# EAGLE design CAN_LED_dimmer_final (EAGLE 7.7.0)
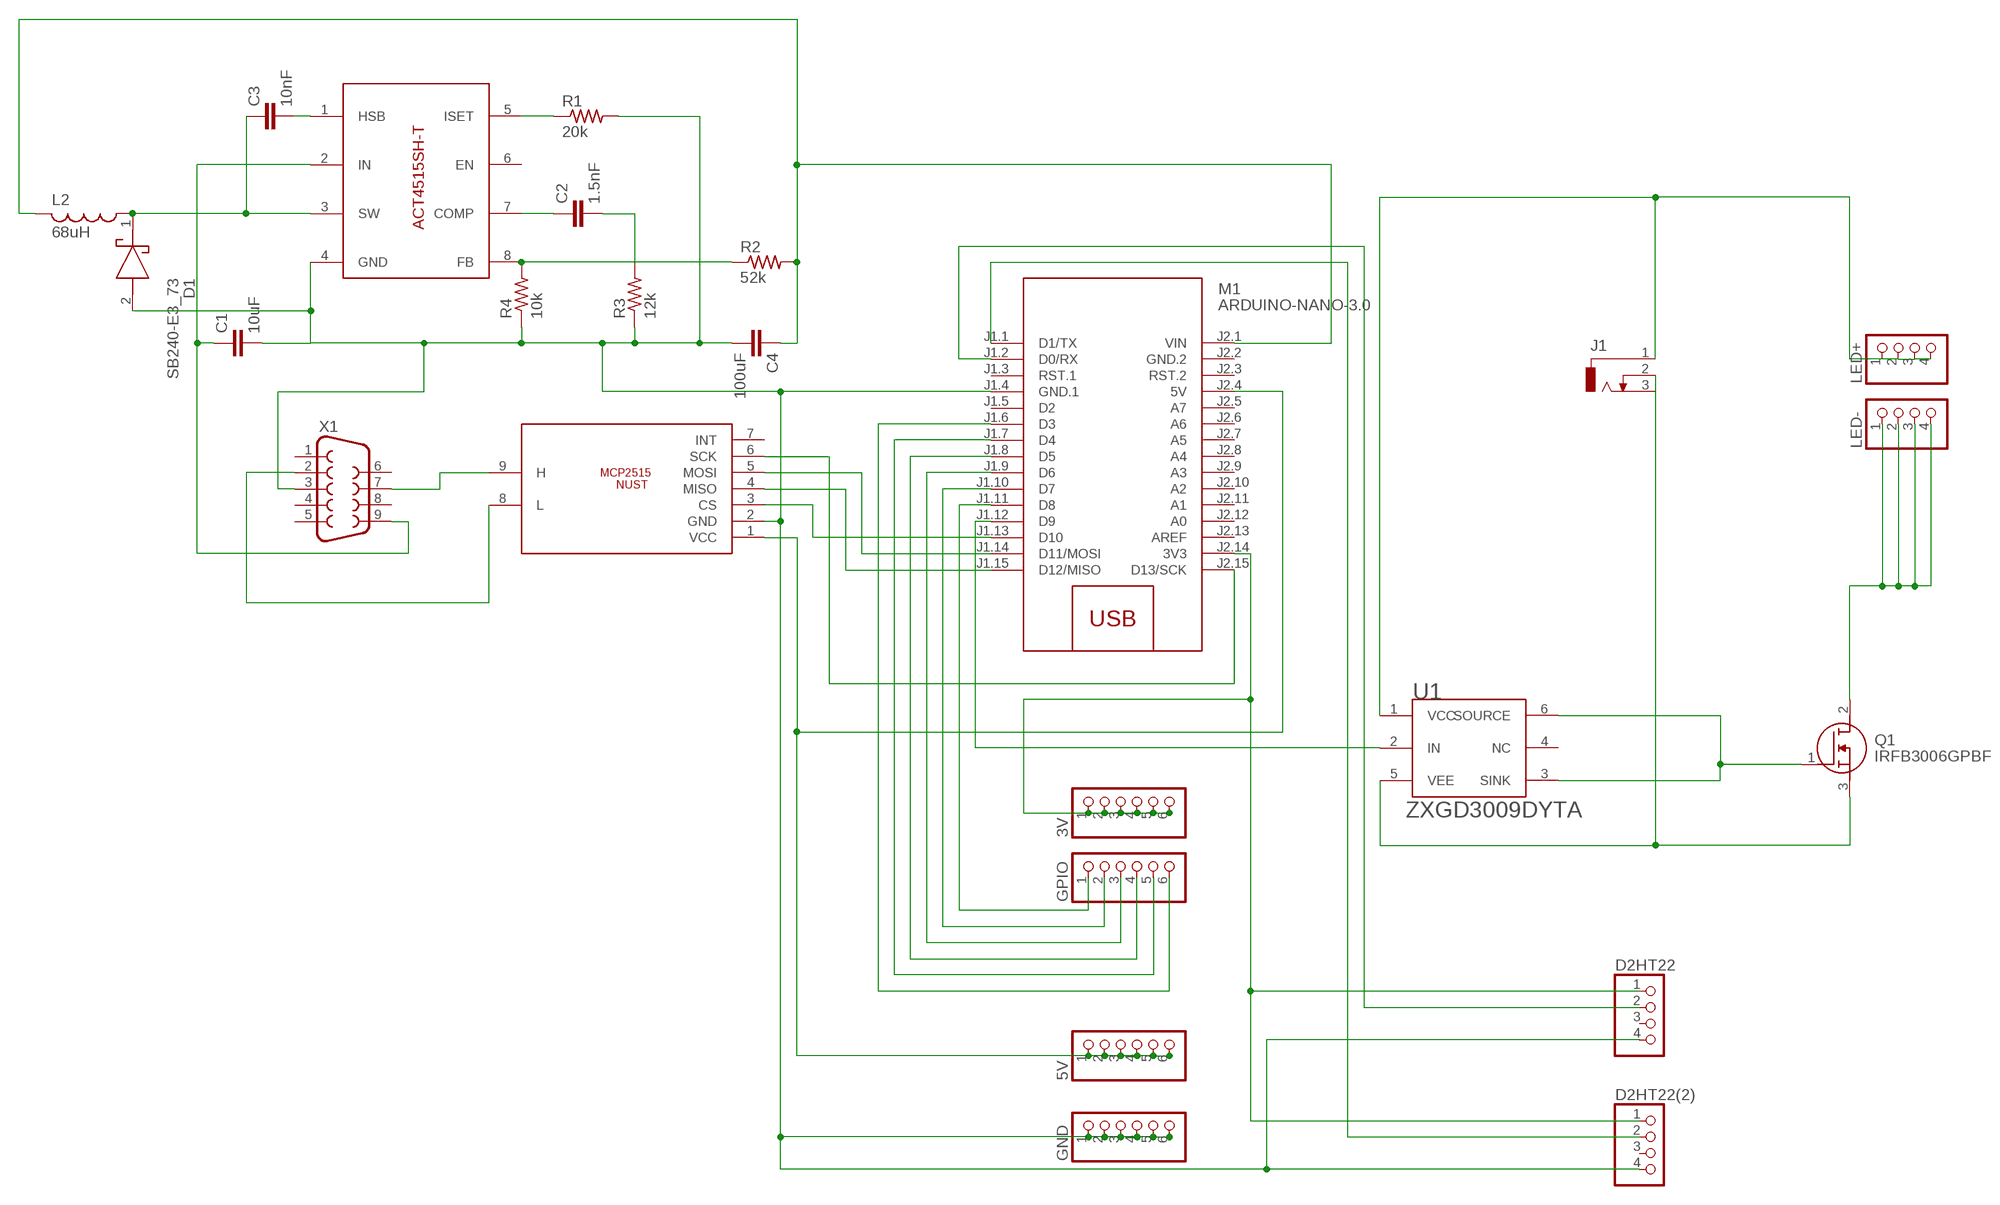
[diagram p0: schematic, sheet 1]

## Parts
3V  PINHD-1X6  [1X06]
5V  PINHD-1X6  [1X06]
C1  10uF  C2,5-3  [C2.5-3]
C2  1.5nF  C2,5-3  [C2.5-3]
C3  10nF  C2,5-3  [C2.5-3]
C4  100uF  C2,5-3  [C2.5-3]
D1  SB240-E3_73  [DIOAD1910W70L670D310]
D2HT22  PINHD-1X4  [1X04]
D2HT22(2)  PINHD-1X4  [1X04]
GND  PINHD-1X6  [1X06]
GPIO  PINHD-1X6  [1X06]
J1  DCJ0303  [DCJ0303]
L2  68uH  L-US0204/7  [0204/7]
LED+  PINHD-1X4  [1X04]
LED-  PINHD-1X4  [1X04]
M1  ARDUINO-NANO-3.0  [ARDUINO-NANO-3.0]
Q1  IRFB3006GPBF  [TO254P420X1016X1994-3P]
R1  20k  R-US_0204/7  [0204/7]
R2  52k  R-US_0204/7  [0204/7]
R3  12k  R-US_0204/7  [0204/7]
R4  10k  R-US_0204/7  [0204/7]
U1  DIODES_ZXGD3009DYTADIODES_ZXGD3009DYTA_0_0  [DIODES_ZXGD3009DYTA_0]
U$1  MCP2515THROUGH_HOLE  [MCP2515]
U$2  ACT4515SH-T  [ACT4515SH-T]
X1  F09D  [F09D]

## Nets
N$1: U$1.9(H) X1.7
N$2: U$1.8(L) X1.2
N$3: M1.J1.15(D12/MISO) U$1.4(MISO)
N$4: M1.J1.14(D11/MOSI) U$1.5(MOSI)
N$5: M1.J2.15(D13/SCK) U$1.6(SCK)
N$6: M1.J1.13(D10) U$1.3(CS)
N$7: 5V.1 5V.2 5V.3 5V.4 5V.5 5V.6 M1.J2.4(5V) U$1.1(VCC)
N$8: C1.2 C4.2 D1.2(A) D2HT22(2).4 D2HT22.4 GND.1 GND.2 GND.3 GND.4 GND.5 GND.6 M1.J1.4(GND.1) R1.2 R3.1 R4.1 U$1.2(GND) U$2.4(GND) X1.3
N$9: C1.1 U$2.2(IN) X1.9
N$11: R1.1 U$2.5(ISET)
N$12: C2.2 R3.2
N$13: C2.1 U$2.7(COMP)
N$14: C3.2 U$2.1(HSB)
N$15: R2.1 R4.2 U$2.8(FB)
N$16: C3.1 D1.1(K) L2.1 U$2.3(SW)
N$17: C4.1 L2.2 M1.J2.1(VIN) R2.2
N$18: J1.2 J1.3 Q1.3(S) U1.5(VEE)
N$20: M1.J1.12(D9) U1.2(IN)
N$22: J1.1 LED+.1 LED+.2 LED+.3 LED+.4 U1.1(VCC)
N$23: LED-.1 LED-.4 Q1.2(D)
N$25: 3V.1 3V.2 3V.3 3V.4 3V.5 3V.6 D2HT22(2).1 D2HT22.1 M1.J2.14(3V3)
N$27: GPIO.1 M1.J1.11(D8)
N$28: GPIO.2 M1.J1.10(D7)
N$29: GPIO.3 M1.J1.9(D6)
N$30: GPIO.4 M1.J1.8(D5)
N$31: GPIO.5 M1.J1.7(D4)
N$32: GPIO.6 M1.J1.6(D3)
N$33: D2HT22(2).2 M1.J1.1(D1/TX)
N$34: D2HT22.2 M1.J1.2(D0/RX)
N$37: Q1.1(G) U1.3(SINK) U1.6(SOURCE)
Unconnected: D2HT22(2).3 D2HT22.3 LED-.2 LED-.3 M1.J1.3(RST.1) M1.J1.5(D2) M1.J2.3(RST.2) M1.J2.5(A7) M1.J2.6(A6) M1.J2.7(A5) M1.J2.8(A4) M1.J2.9(A3) M1.J2.10(A2) M1.J2.11(A1) M1.J2.12(A0) M1.J2.13(AREF) U1.4(NC) U$1.7(INT) U$2.6(EN) X1.1 X1.4 X1.5 X1.6 X1.8

## Power pins joined to a net without a drawn wire
GND.2: M1.J2.2(GND.2)

## Library data of the parts
3V 5V GND GPIO = pinhead:PINHD-1X6: PIN HEADER
C1-C4 = capacitor-wima:C: CAPACITOR naming: grid - package width
D1 = SB240-E3_73:SB240-E3_73: Schottky Diodes & Rectifiers 40 Volt 2.0 Amp 60 Amp IFSM Source: Datasheet; DESCRIPTION: Schottky Diodes & Rectifiers 40 Volt 2.0 Amp 60 Amp IFSM; HEIGHT: mm; MANUFACTURER_NAME: Vishay; MANUFACTURER_PART_NUMBER: SB240-E3/73
D2HT22 D2HT22(2) LED+ LED- = pinhead:PINHD-1X4: PIN HEADER
J1 = con-jack:DCJ0303: DC POWER JACK Source: DCJ0303.pdf; OC_FARNELL: unknown; OC_NEWARK: unknown
L2 = rcl:L-US: INDUCTOR, American symbol
M1 = diy-modules:ARDUINO-NANO-3.0: Arduino Nano 3.0 and compatible devices More details available here: https://www.arduino.cc/en/Main/ArduinoBoardNano Click here to find device on ebay.com <http://www.ebay.com/sch/arduino+nano>
Q1 = IRFB3006GPBF:IRFB3006GPBF: Infineon IRFB3006GPBF N-channel MOSFET, 270 A, 60 V HEXFET, 3-Pin TO-220AB Source: Datasheet <https://datasheet.octopart.com/IRFB3006GPBF-Infineon-datasheet-8552866.pdf>; DESCRIPTION: Infineon IRFB3006GPBF N-channel MOSFET, 270 A, 60 V HEXFET, 3-Pin TO-220AB; HEIGHT: 4.195mm; MANUFACTURER_NAME: Infineon; MANUFACTURER_PART_NUMBER: IRFB3006GPBF
R1-R4 = rcl:R-US_: RESISTOR, American symbol
U1 = Diodes - ZXGD3009DYTA:DIODES_ZXGD3009DYTA: 40V 1A GATE DRIVER IN SOT363; CENTROID_NOT_SPECIFIED: No; DATASHEET: http://www.diodes.com/_files/datasheets/ZXGD3009DY.pdf; DIGIKEY_DESCRIPTION: IC GATE DRVR IGBT/MOSFET SOT363; DIGIKEY_PART_NUMBER: ZXGD3009DYTADICT-ND; IPC_LAND_PATTERN_NAME: SOT65P210X105-6; LEAD_FREE: yes; MF: Diodes; MOUSER_PART_NUMBER: 621-ZXGD3009DYTA; MPN: ZXGD3009DYTA; PACKAGE: SOT-363; PREFIX: U; ROHS: yes; TEMPERATURE_RANGE_HIGH: +150°C; TEMPERATURE_RANGE_LOW: -55°C
U$1 = MCP2515:MCP2515
U$2 = ACT4515SH-T:ACT4515SH-T
X1 = con-subd:F09: SUB-D; OC_FARNELL: unknown; OC_NEWARK: unknown

## Board
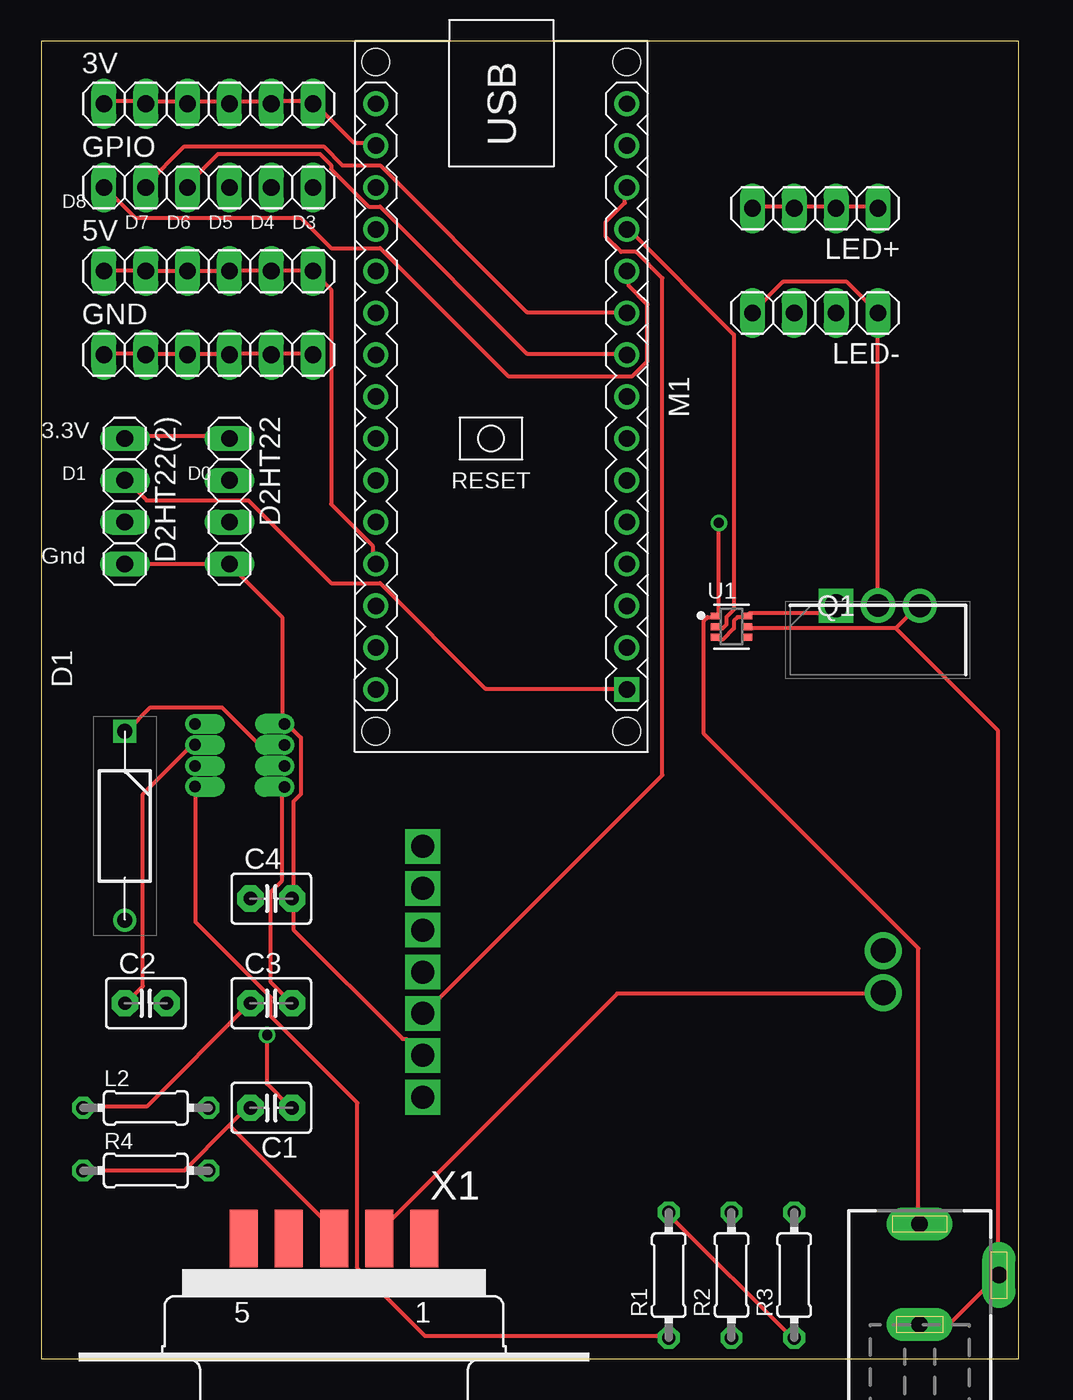
[diagram p1: board, top side]
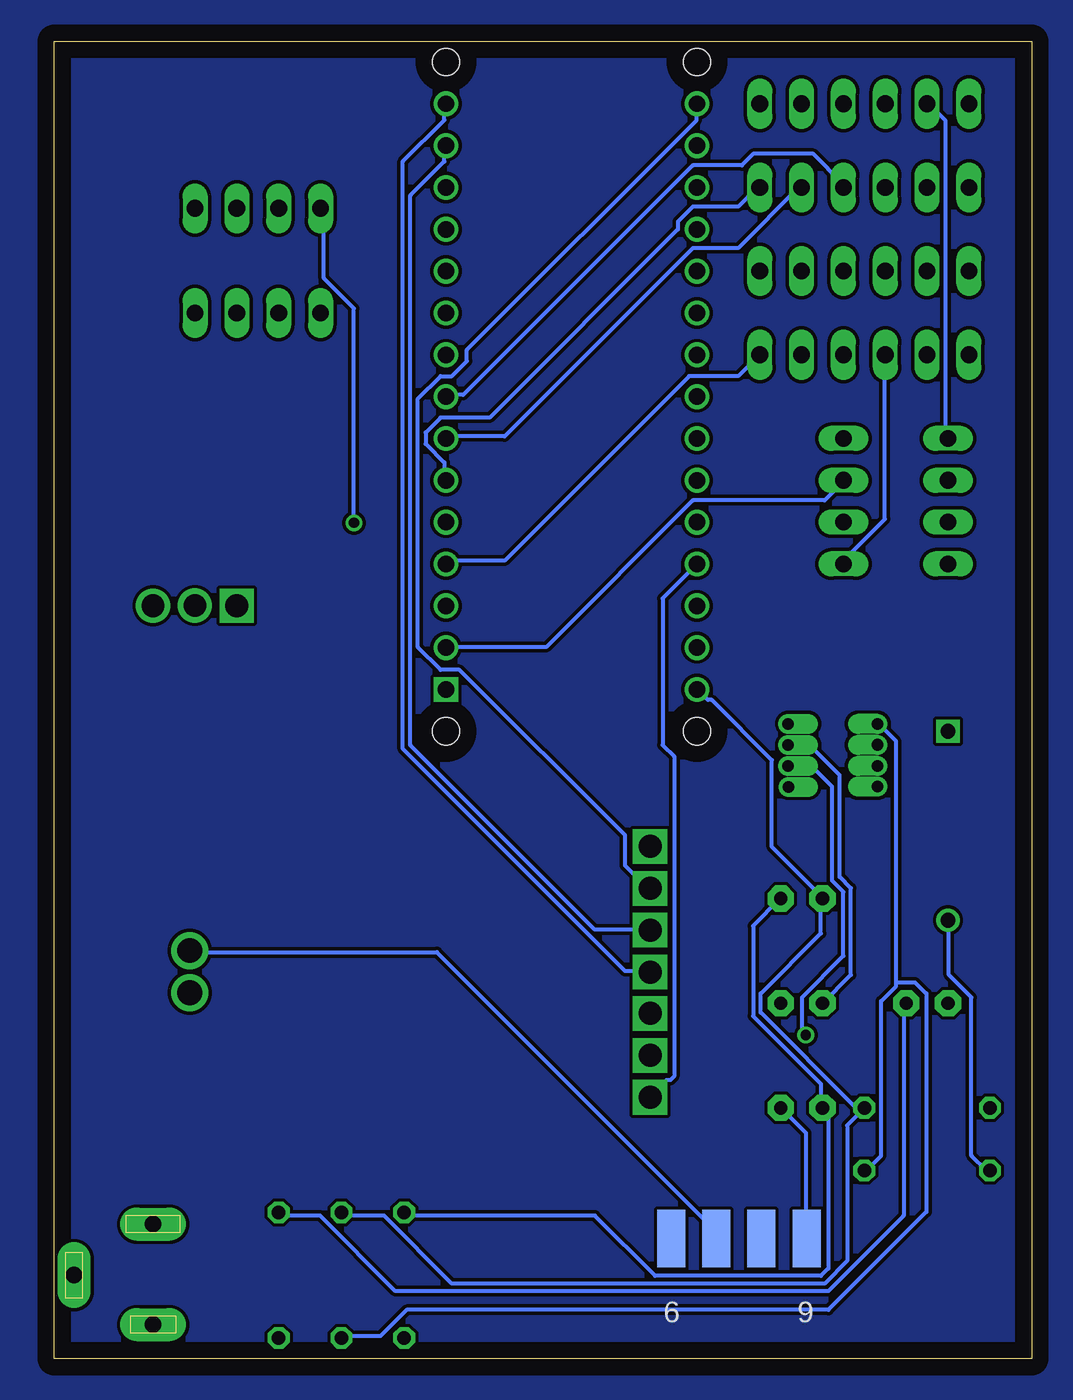
[diagram p2: board, bottom side, seen from below]

Size 59.36 x 80 mm. Coordinates in mm from the lower left corner, seen from the top.
Outline: 0,0 59.36,0 59.36,80 0,80 0,0
Copper layers (1*16): Top 0.035mm / dielectric 1.5mm / Bottom 0.035mm
Design rules "default": minimum track width 10mil, minimum drill 24mil, track to track 8mil, track to pad 8mil, pad to pad 8mil, via to via 8mil, smd to smd 8mil, copper to edge 40mil, drill to drill 8mil, minimum pad ring 10mil, minimum via ring 8mil, stop-mask expansion 4mil, vias tented up to drill 0mil, thermal gap 10mil

### Footprints (pad centres in the part's own frame; a part is rotated, then mirrored left to right if it is on the bottom)
1X06 = drill 1.016 long: 1 -6.35,0; 2 -3.81,0; 3 -1.27,0; 4 1.27,0; 5 3.81,0; 6 6.35,0
C2.5-3 = drill 0.813 pad 1.6 octagon: 1 -1.27,0; 2 1.27,0
DIOAD1910W70L670D310 = drill 0.9 pad 1.35 square: 1 3.81,0 | drill 0.9 pad 1.35: 2 15.29,0
1X04 = drill 1.016 long: 1 -3.81,0; 2 -1.27,0; 3 1.27,0; 4 3.81,0
DCJ0303 = drill 1 pad 2 long: 1 0,3.1; 2 4.8,0; 3 0,-3
0204/7 = drill 0.813 octagon: 1 -3.81,0; 2 3.81,0
ARDUINO-NANO-3.0 = drill 1 square: J1.1 17.78,7.62 | drill 1: J1.2 15.24,7.62; J1.3 12.7,7.62; J1.4 10.16,7.62; J1.5 7.62,7.62; J1.6 5.08,7.62; J1.7 2.54,7.62; J1.8 0,7.62; J1.9 -2.54,7.62; J1.10 -5.08,7.62; J1.11 -7.62,7.62; J1.12 -10.16,7.62; J1.13 -12.7,7.62; J1.14 -15.24,7.62; J1.15 -17.78,7.62; J2.1 17.78,-7.62; J2.2 15.24,-7.62; J2.3 12.7,-7.62; J2.4 10.16,-7.62; J2.5 7.62,-7.62; J2.6 5.08,-7.62; J2.7 2.54,-7.62; J2.8 0,-7.62; J2.9 -2.54,-7.62; J2.10 -5.08,-7.62; J2.11 -7.62,-7.62; J2.12 -10.16,-7.62; J2.13 -12.7,-7.62; J2.14 -15.24,-7.62; J2.15 -17.78,-7.62 | hole 1.651: -20.32,7.62; -20.32,-7.62; 20.32,-7.62; 20.32,7.62
TO254P420X1016X1994-3P = drill 1.38 pad 2.07 square: 1 0,0 | drill 1.38 pad 2.07: 2 2.545,0.02; 3 5.09,0
DIODES_ZXGD3009DYTA_0 = smd 0.6 x 0.42: 1 -0.95,0.65; 2 -0.95,0; 3 -0.95,-0.65; 4 0.95,-0.65; 5 0.95,0; 6 0.95,0.65
MCP2515 = drill 1.4 pad 1.676 square: 1 -5.706,17.475; 2 -3.164,17.475; 3 -0.621,17.475; 4 1.892,17.475; 5 4.435,17.475; 6 6.977,17.475; 7 9.52,17.475 | drill 1.5 pad 1.93: 8 0.638,-10.48; 9 3.192,-10.48
ACT4515SH-T = drill 0.7 pad 0.813 offset: 1 0.439,-0.807; 2 1.715,-0.814; 3 2.985,-0.817; 4 4.26,-0.814; 5 0.445,4.619; 6 1.71,4.619; 7 2.993,4.619; 8 4.259,4.619
F09D = smd 1.7 x 3.5: 1 -5.486,-6.045; 2 -2.743,-6.045; 3 0,-6.045; 4 2.743,-6.045; 5 5.486,-6.045 | smd 1.7 x 3.5 bottom: 6 -4.115,-6.045; 7 -1.372,-6.045; 8 1.372,-6.045; 9 4.115,-6.045

### Placement (x,y rotation side)
3V  10.16,76.2 0 top
5V  10.16,66.04 0 top
C1  13.97,15.24 180 top
C2  6.35,21.59 0 top
C3  13.97,21.59 0 top
C4  13.97,27.94 0 top
D1  5.08,41.91 270 top
D2HT22  11.43,52.07 270 top
D2HT22(2)  5.08,52.07 270 top
GND  10.16,60.96 0 top
GPIO  10.16,71.12 0 top
J1  53.34,5.08 0 top
L2  6.35,15.24 0 top
LED+  46.99,69.85 180 top
LED-  46.99,63.5 180 top
M1  27.94,58.42 270 top
Q1  48.26,45.72 0 top
R1  38.1,5.08 90 top
R2  41.91,5.08 90 top
R3  45.72,5.08 90 top
R4  6.35,11.43 0 top
U1  41.91,44.45 0 top
U$1  40.64,21.59 90 top
U$2  13.97,34.29 90 top
X1  17.78,1.27 180 top

### Tracks (layer width: path | path; a pad name or v marks a point on that pad's centre or on a via)
GND
  pour Bottom: -1.27,82.55 63.5,82.55 63.5,-8.89 -5.08,-8.89 -5.08,82.55
N$1
  Bottom 0.254: X1.7 19.2,7.32 19.2,7.77 36.12,24.69 50.98,24.69 U$1.9
N$2
  Top 0.254: X1.2 20.57,7.32 20.57,7.77 34.98,22.17 50.98,22.17 U$1.8
N$3
  Bottom 0.254: M1.J1.15 35.66,76.12 35.66,75.21 38.18,72.69 38.18,37.03 24.69,23.55 23.32,23.55 U$1.4
N$4
  Bottom 0.254: M1.J1.14 35.66,73.61 35.66,72.69 37.72,70.64 37.72,37.26 26.52,26.06 23.32,26.06 U$1.5
N$5
  Bottom 0.254: M1.J2.15 20.34,76.12 20.34,75.21 34.29,61.27 34.29,60.58 35.2,59.66 35.89,59.66 37.26,58.29 37.26,43.2 35.89,41.83 34.75,41.83 24.69,31.77 24.69,29.95 23.32,28.57 U$1.6
N$6
  Top 0.254: M1.J1.13 35.43,71.09 35.43,70.18 34.29,69.04 34.29,68.12 35.2,67.21 36.12,67.21 37.72,65.61 37.72,35.43 23.32,21.03 U$1.3
N$7
  Top 0.254: 5V.1 3.89,66.06 6.17,66.06 5V.2 6.4,66.06 8.69,66.06 5V.3 8.91,66.06 11.43,66.06 | M1.J2.4 20.12,48.46 20.12,49.38 17.6,51.89 17.6,64.92 16.69,65.84 5V.6 16.46,66.06 14.17,66.06 5V.5 13.95,66.06 11.43,66.06 | 11.43,66.06 5V.4
  Bottom 0.254: M1.J2.4 22.4,46.18 22.4,37.26 21.72,36.58 21.72,17.14 21.95,16.92 22.17,16.92 23.09,16 U$1.1
N$8
  Top 0.254: R1.2 38.18,8.69 45.72,1.14 R3.1 | R4.1 8.69,11.43 11.43,14.17 | 11.43,14.17 12.57,15.32 C1.2 | 11.43,14.17 17.6,8 17.6,7.32 X1.3 | GND.1 3.89,61.04 6.17,61.04 GND.2 6.4,61.04 8.69,61.04 GND.3 8.91,61.04 11.43,61.04 | GND.6 16.46,61.04 14.17,61.04 GND.5 13.95,61.04 11.43,61.04 | 11.43,61.04 GND.4 | 11.43,48.23 14.63,45.03 14.63,38.63 U$2.4 14.86,38.63 15.77,37.72 15.77,34.29 15.32,33.83 15.32,28.12 C4.2 15.32,27.89 15.32,26.06 21.95,19.43 22.17,19.43 23.09,18.52 U$1.2 | 11.43,48.23 5.26,48.23 D2HT22(2).4 | 11.43,48.23 D2HT22.4
  Bottom 0.254: D1.2 5.03,26.52 5.03,23.32 3.66,21.95 3.66,12.34 2.74,11.43 R4.1 | R1.2 37.95,8.69 26.52,8.69 22.86,5.03 12.8,5.03 12.34,5.49 12.34,14.86 12.57,15.09 C1.2 12.8,15.32 12.8,16.69 16.92,20.8 16.92,26.29 15.32,27.89 C4.2 | M1.J1.4 35.43,48.46 32,48.46 20.8,59.66 17.83,59.66 16.69,60.81 GND.6 | GND.3 8.91,60.81 8.91,50.98 11.43,48.46 D2HT22.4
N$9  (via drill 0.61)
  Top 0.254: v13.72,19.66 13.72,16.69 15.09,15.32 C1.1
  Bottom 0.254: v13.72,19.66 13.95,19.89 13.95,21.95 11.43,24.46 11.43,28.35 12.12,29.03 12.12,34.75 13.26,35.89 14.63,35.89 U$2.2 | C1.1 13.72,13.72 13.72,7.32 X1.9
N$11
  Top 0.254: U$2.5 9.37,34.52 9.37,26.52 13.95,21.95 13.95,20.8 19.2,15.54 19.2,5.49 23.32,1.37 37.95,1.37 R1.1
N$12
  Bottom 0.254: R3.2 45.72,8.69 43.2,8.69 38.63,4.12 12.34,4.12 7.77,8.69 7.77,21.49 C2.2
N$13
  Top 0.254: U$2.7 9.14,37.26 6.17,34.29 6.17,22.63 5.26,21.72 C2.1
N$14
  Top 0.254: U$2.1 14.63,34.52 14.63,29.03 13.95,28.35 13.95,22.86 15.09,21.72 C3.2
N$15
  Bottom 0.254: 8.23,22.86 8.23,22.63 9.14,21.72 9.14,12.34 10.06,11.43 R4.2 | 8.23,22.86 8.23,37.49 9.14,38.41 U$2.8 | 8.23,22.86 7.09,22.86 6.4,22.17 6.4,8.91 12.34,2.97 37.95,2.97 39.55,1.37 41.83,1.37 R2.1
N$16
  Top 0.254: U$2.3 14.63,37.49 13.03,37.49 10.97,39.55 6.63,39.55 5.26,38.18 D1.1 | L2.1 2.74,15.32 6.4,15.32 12.57,21.49 C3.1
  Bottom 0.254: C3.1 10.97,23.32 10.97,28.57 11.66,29.26 11.66,35.43 13.49,37.26 14.63,37.26 U$2.3
N$17
  Bottom 0.254: M1.J2.1 20.12,40.46 19.66,40.01 19.43,40.01 15.77,36.35 15.77,31.09 12.8,28.12 C4.1 12.8,27.89 12.8,25.83 16.46,22.17 16.46,21.03 10.74,15.32 10.29,15.32 L2.2 10.29,15.09 11.2,14.17 11.2,5.94 12.57,4.57 35.2,4.57 39.32,8.69 41.83,8.69 R2.2
N$18
  Top 0.254: J1.3 53.49,2.29 55.32,2.29 58.06,5.03 J1.2 58.06,5.26 58.06,38.18 51.89,44.35 | 51.89,44.35 42.98,44.35 U1.5 | 51.89,44.35 53.26,45.72 Q1.3
N$20
  Top 0.254: U1.2 41.15,44.35 41.38,44.35 41.6,44.58 41.6,45.03 42.06,45.49 42.06,62.18 35.66,68.58 M1.J1.12
N$22  (via drill 0.61)
  Top 0.254: 45.72,69.95 43.2,69.95 LED+.4 | LED+.1 50.75,69.95 48.46,69.95 LED+.2 48.23,69.95 45.72,69.95 | 45.72,69.95 LED+.3 | J1.1 53.26,8.23 53.26,24.92 40.23,37.95 40.23,44.81 40.46,45.03 40.92,45.03 U1.1 41.15,45.26 v41.15,50.75
  Bottom 0.254: v41.15,50.75 41.15,63.78 42.98,65.61 42.98,69.72 LED+.4
N$23
  Top 0.254: LED-.4 43.2,63.55 45.03,65.38 48.92,65.38 LED-.1 50.75,63.32 50.75,45.95 Q1.2
N$25
  Top 0.254: M1.J2.14 20.12,73.84 18.97,73.84 16.69,76.12 3V.6 16.46,76.35 14.17,76.35 3V.5 13.95,76.35 11.43,76.35 | D2HT22(2).1 5.26,56.01 11.43,56.01 D2HT22.1 | 3V.1 3.89,76.35 6.17,76.35 3V.2 6.4,76.35 8.69,76.35 3V.3 8.91,76.35 11.43,76.35 | 11.43,76.35 3V.4
  Bottom 0.254: D2HT22(2).1 5.26,56.01 5.26,75.21 6.17,76.12 3V.2
N$27
  Top 0.254: M1.J1.11 35.66,65.84 35.66,65.15 36.8,64.01 36.8,60.58 35.89,59.66 28.35,59.66 20.57,67.44 17.6,67.44 15.77,69.27 5.71,69.27 3.89,71.09 GPIO.1
N$28
  Top 0.254: M1.J1.10 35.43,63.55 29.49,63.55 20.57,72.47 18.29,72.47 17.14,73.61 8.69,73.61 6.4,71.32 GPIO.2
N$29
  Top 0.254: M1.J1.9 35.43,61.04 29.49,61.04 20.57,69.95 19.89,69.95 17.6,72.24 17.6,72.47 16.92,73.15 10.74,73.15 8.91,71.32 GPIO.3
N$30
  Bottom 0.254: M1.J1.8 35.43,58.52 34.52,58.52 20.57,72.47 17.6,72.47 16.92,73.15 13.26,73.15 11.43,71.32 GPIO.4
N$31
  Bottom 0.254: M1.J1.7 35.43,56.01 32,56.01 20.57,67.44 17.83,67.44 14.17,71.09 GPIO.5
N$32
  Bottom 0.254: M1.J1.6 35.66,53.49 35.66,54.41 36.8,55.55 36.8,56.24 35.89,57.15 32.92,57.15 21.49,68.58 21.49,69.04 20.57,69.95 17.83,69.95 16.69,71.09 GPIO.6
N$33
  Top 0.254: M1.J1.1 35.43,40.69 26.98,40.69 20.57,47.09 17.6,47.09 12.57,52.12 6.4,52.12 5.26,53.26 D2HT22(2).2
N$34
  Bottom 0.254: M1.J1.2 35.43,43.2 29.49,43.2 20.57,52.12 12.57,52.12 11.43,53.26 D2HT22.2
N$37
  Top 0.254: U1.3 41.15,43.66 41.38,43.66 42.06,44.35 42.06,44.81 42.29,45.03 42.75,45.03 U1.6 42.98,45.26 47.78,45.26 48.23,45.72 Q1.1

### Text on the board
tPlace: D8 | D7 | D6 | D5 | D4 | D3 | 3.3V | D1 | D0 | Gnd